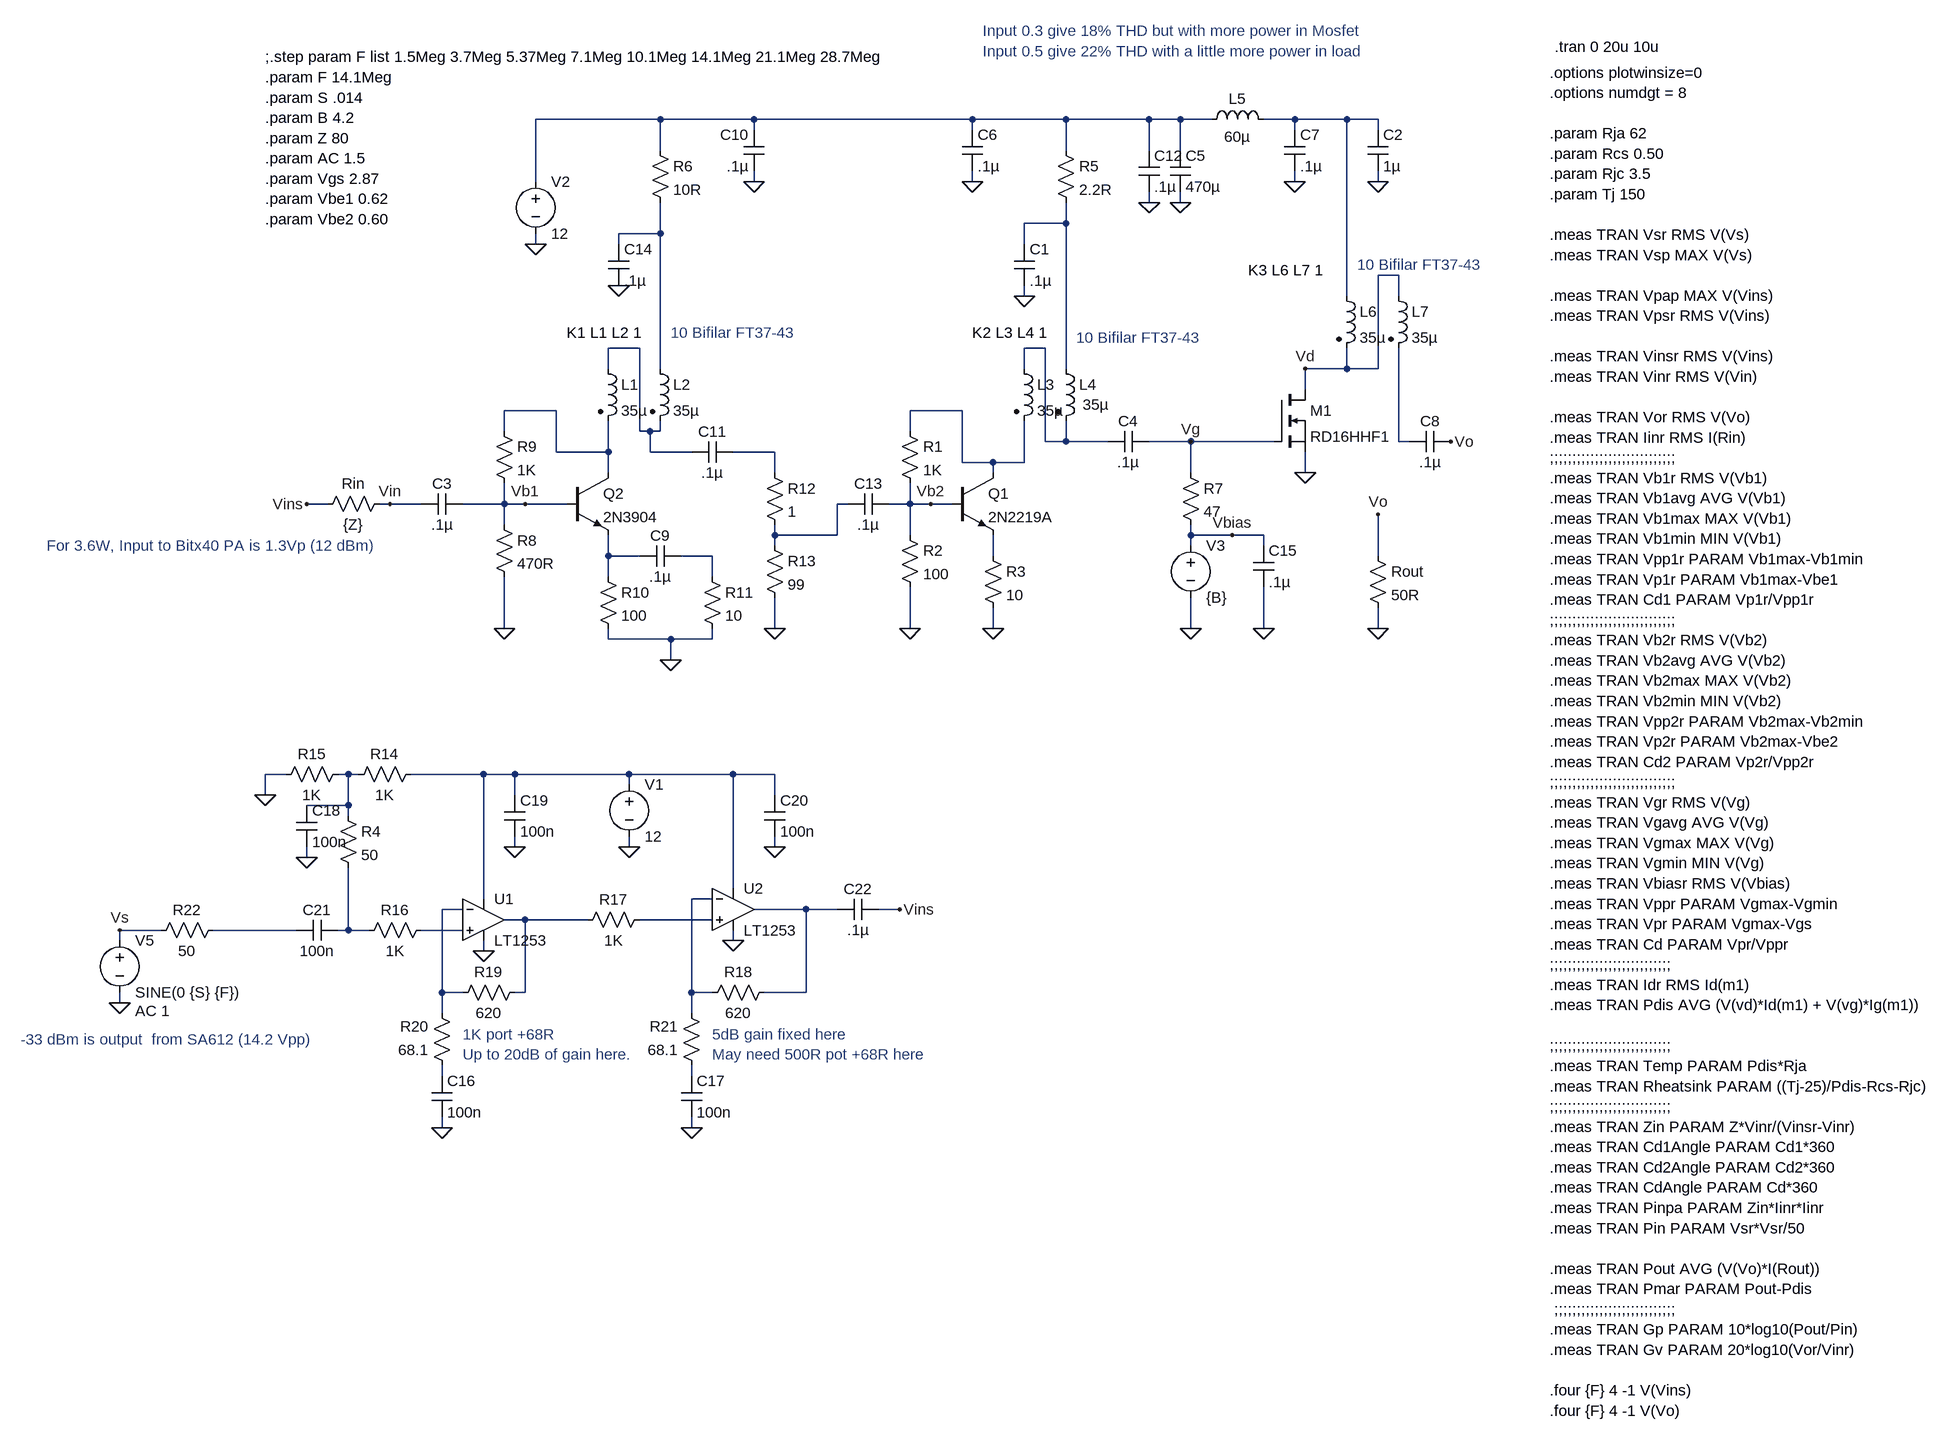
[diagram p0: schematic LT1253+Bitx40 RD16HHF Power Amp.asc]
LT1253+Bitx40 RD16HHF Power Amp.asc, the LTspice schematic file:
Version 4
SHEET 1 3060 1616
WIRE 320 -400 128 -400
WIRE 464 -400 320 -400
WIRE 800 -400 464 -400
WIRE 944 -400 800 -400
WIRE 1072 -400 944 -400
WIRE 1120 -400 1072 -400
WIRE 1168 -400 1120 -400
WIRE 1296 -400 1248 -400
WIRE 1376 -400 1296 -400
WIRE 1424 -400 1376 -400
WIRE 464 -384 464 -400
WIRE 800 -384 800 -400
WIRE 1296 -384 1296 -400
WIRE 1424 -384 1424 -400
WIRE 320 -352 320 -400
WIRE 944 -352 944 -400
WIRE 1072 -352 1072 -400
WIRE 1120 -352 1120 -400
WIRE 128 -304 128 -400
WIRE 464 -304 464 -320
WIRE 800 -304 800 -320
WIRE 1296 -304 1296 -320
WIRE 1424 -304 1424 -320
WIRE 1072 -272 1072 -288
WIRE 1120 -272 1120 -288
WIRE 944 -240 944 -272
WIRE 944 -240 880 -240
WIRE 320 -224 320 -272
WIRE 320 -224 256 -224
WIRE 128 -208 128 -224
WIRE 256 -208 256 -224
WIRE 880 -208 880 -240
WIRE 1456 -160 1424 -160
WIRE 880 -128 880 -144
WIRE 1376 -128 1376 -400
WIRE 1456 -128 1456 -160
WIRE 288 -48 240 -48
WIRE 912 -48 880 -48
WIRE 240 -16 240 -48
WIRE 320 -16 320 -224
WIRE 880 -16 880 -48
WIRE 944 -16 944 -240
WIRE 1376 -16 1376 -48
WIRE 1376 -16 1312 -16
WIRE 1424 -16 1424 -160
WIRE 1424 -16 1376 -16
WIRE 1312 16 1312 -16
WIRE 160 48 80 48
WIRE 784 48 704 48
WIRE 80 80 80 48
WIRE 288 80 288 -48
WIRE 304 80 288 80
WIRE 320 80 320 64
WIRE 320 80 304 80
WIRE 704 80 704 48
WIRE 912 96 912 -48
WIRE 944 96 944 64
WIRE 944 96 912 96
WIRE 1008 96 944 96
WIRE 1136 96 1072 96
WIRE 1264 96 1136 96
WIRE 1456 96 1456 -48
WIRE 1472 96 1456 96
WIRE 160 112 160 48
WIRE 240 112 240 64
WIRE 240 112 160 112
WIRE 304 112 304 80
WIRE 368 112 304 112
WIRE 496 112 432 112
WIRE 784 128 784 48
WIRE 832 128 784 128
WIRE 880 128 880 64
WIRE 880 128 832 128
WIRE 240 144 240 112
WIRE 496 144 496 112
WIRE 832 144 832 128
WIRE 1136 144 1136 96
WIRE 1312 144 1312 112
WIRE -192 192 -224 192
WIRE -96 192 -112 192
WIRE -48 192 -96 192
WIRE 80 192 80 160
WIRE 80 192 16 192
WIRE 112 192 80 192
WIRE 176 192 112 192
WIRE 608 192 592 192
WIRE 704 192 704 160
WIRE 704 192 672 192
WIRE 736 192 704 192
WIRE 768 192 736 192
WIRE 80 224 80 192
WIRE 496 240 496 224
WIRE 592 240 592 192
WIRE 592 240 496 240
WIRE 704 240 704 192
WIRE 1136 240 1136 224
WIRE 1200 240 1136 240
WIRE 1248 240 1200 240
WIRE 496 256 496 240
WIRE 1136 256 1136 240
WIRE 1248 256 1248 240
WIRE 240 272 240 240
WIRE 288 272 240 272
WIRE 400 272 352 272
WIRE 832 272 832 240
WIRE 1424 272 1424 208
WIRE 240 304 240 272
WIRE 400 304 400 272
WIRE 80 384 80 304
WIRE 496 384 496 336
WIRE 704 384 704 320
WIRE 832 384 832 352
WIRE 1136 384 1136 336
WIRE 1248 384 1248 320
WIRE 1424 384 1424 352
WIRE 240 400 240 384
WIRE 336 400 240 400
WIRE 400 400 400 384
WIRE 400 400 336 400
WIRE 336 432 336 400
WIRE -256 608 -288 608
WIRE -160 608 -176 608
WIRE -144 608 -160 608
WIRE 48 608 -64 608
WIRE 96 608 48 608
WIRE 272 608 96 608
WIRE 432 608 272 608
WIRE 496 608 432 608
WIRE 272 624 272 608
WIRE -288 640 -288 608
WIRE 96 640 96 608
WIRE 496 640 496 608
WIRE -160 656 -160 608
WIRE -160 656 -224 656
WIRE -160 672 -160 656
WIRE 96 720 96 704
WIRE 272 720 272 704
WIRE 496 720 496 704
WIRE -224 736 -224 720
WIRE 432 784 432 608
WIRE 48 800 48 608
WIRE 400 800 368 800
WIRE 16 816 -16 816
WIRE 544 816 464 816
WIRE 592 816 544 816
WIRE 688 816 656 816
WIRE 112 832 80 832
WIRE 208 832 112 832
WIRE 400 832 288 832
WIRE -448 848 -512 848
WIRE -240 848 -368 848
WIRE -160 848 -160 752
WIRE -160 848 -176 848
WIRE -128 848 -160 848
WIRE 16 848 -48 848
WIRE -512 864 -512 848
WIRE 432 864 432 848
WIRE 48 880 48 864
WIRE -16 944 -16 816
WIRE 16 944 -16 944
WIRE 112 944 112 832
WIRE 112 944 96 944
WIRE 368 944 368 800
WIRE 400 944 368 944
WIRE 544 944 544 816
WIRE 544 944 480 944
WIRE -512 960 -512 944
WIRE -16 976 -16 944
WIRE 368 976 368 944
WIRE -16 1072 -16 1056
WIRE 368 1072 368 1056
WIRE -16 1152 -16 1136
WIRE 368 1152 368 1136
FLAG 704 384 0
FLAG 832 384 0
FLAG 128 -208 0
FLAG 880 -128 0
FLAG 1136 384 0
FLAG 1312 144 0
FLAG 1120 -272 0
FLAG 800 -304 0
FLAG 1296 -304 0
FLAG -96 192 Vin
FLAG -224 192 Vins
FLAG 1536 96 Vo
FLAG 464 -304 0
FLAG 336 432 0
FLAG 80 384 0
FLAG 496 384 0
FLAG 1424 -304 0
FLAG 1072 -272 0
FLAG 1424 384 0
FLAG 1424 208 Vo
FLAG 256 -144 0
FLAG 1248 384 0
FLAG 1136 96 Vg
FLAG 1200 240 Vbias
FLAG 1312 -16 Vd
FLAG 736 192 Vb2
FLAG 112 192 Vb1
FLAG 96 720 0
FLAG -224 736 0
FLAG 48 880 0
FLAG 432 864 0
FLAG 368 1152 0
FLAG 496 720 0
FLAG -288 640 0
FLAG -16 1152 0
FLAG 688 816 Vins
FLAG 272 720 0
FLAG -512 960 0
FLAG -512 848 Vs
SYMBOL npn 768 144 R0
SYMATTR InstName Q1
SYMATTR Value 2N2219A
SYMBOL res 688 64 R0
SYMATTR InstName R1
SYMATTR Value 1K
SYMBOL res 688 224 R0
SYMATTR InstName R2
SYMATTR Value 100
SYMBOL res 816 256 R0
SYMATTR InstName R3
SYMATTR Value 10
SYMBOL voltage 128 -320 R0
WINDOW 123 0 0 Left 2
WINDOW 39 0 0 Left 2
SYMATTR InstName V2
SYMATTR Value 12
SYMBOL ind2 224 -32 R0
SYMATTR InstName L1
SYMATTR Value 35µ
SYMATTR Type ind
SYMBOL ind2 304 -32 R0
SYMATTR InstName L2
SYMATTR Value 35µ
SYMATTR Type ind
SYMBOL res 928 -368 R0
SYMATTR InstName R5
SYMATTR Value 2.2R
SYMBOL cap 864 -208 R0
SYMATTR InstName C1
SYMATTR Value .1µ
SYMBOL res -96 176 R90
WINDOW 0 0 56 VBottom 2
WINDOW 3 32 56 VTop 2
SYMATTR InstName Rin
SYMATTR Value {Z}
SYMBOL cap 16 176 R90
WINDOW 0 0 32 VBottom 2
WINDOW 3 32 32 VTop 2
SYMATTR InstName C3
SYMATTR Value .1µ
SYMBOL cap 1072 80 R90
WINDOW 0 0 32 VBottom 2
WINDOW 3 32 32 VTop 2
SYMATTR InstName C4
SYMATTR Value .1µ
SYMBOL voltage 1136 240 R0
WINDOW 123 0 0 Left 2
WINDOW 39 0 0 Left 2
SYMATTR InstName V3
SYMATTR Value {B}
SYMBOL res 1120 128 R0
SYMATTR InstName R7
SYMATTR Value 47
SYMBOL ind2 864 -32 R0
SYMATTR InstName L3
SYMATTR Value 35µ
SYMATTR Type ind
SYMBOL ind2 928 -32 R0
WINDOW 3 42 71 Left 2
SYMATTR Value 35µ
SYMATTR InstName L4
SYMATTR Type ind
SYMBOL ind 1152 -384 R270
WINDOW 0 32 56 VTop 2
WINDOW 3 5 56 VBottom 2
SYMATTR InstName L5
SYMATTR Value 60µ
SYMBOL cap 1104 -352 R0
SYMATTR InstName C5
SYMATTR Value 470µ
SYMBOL cap 784 -384 R0
SYMATTR InstName C6
SYMATTR Value .1µ
SYMBOL cap 1280 -384 R0
SYMATTR InstName C7
SYMATTR Value .1µ
SYMBOL cap 1536 80 R90
WINDOW 0 0 32 VBottom 2
WINDOW 3 32 32 VTop 2
SYMATTR InstName C8
SYMATTR Value .1µ
SYMBOL npn 176 144 R0
SYMATTR InstName Q2
SYMATTR Value 2N3904
SYMBOL res 64 208 R0
SYMATTR InstName R8
SYMATTR Value 470R
SYMBOL res 64 64 R0
SYMATTR InstName R9
SYMATTR Value 1K
SYMBOL res 224 288 R0
SYMATTR InstName R10
SYMATTR Value 100
SYMBOL res 384 288 R0
SYMATTR InstName R11
SYMATTR Value 10
SYMBOL cap 352 256 R90
WINDOW 0 0 32 VBottom 2
WINDOW 3 32 32 VTop 2
SYMATTR InstName C9
SYMATTR Value .1µ
SYMBOL cap 480 -320 R180
WINDOW 0 24 56 Left 2
WINDOW 3 24 8 Left 2
SYMATTR InstName C10
SYMATTR Value .1µ
SYMBOL cap 368 128 R270
WINDOW 0 32 32 VTop 2
WINDOW 3 0 32 VBottom 2
SYMATTR InstName C11
SYMATTR Value .1µ
SYMBOL ind2 1360 -144 R0
SYMATTR InstName L6
SYMATTR Value 35µ
SYMATTR Type ind
SYMBOL ind2 1440 -144 R0
SYMATTR InstName L7
SYMATTR Value 35µ
SYMATTR Type ind
SYMBOL res 480 128 R0
SYMATTR InstName R12
SYMATTR Value 1
SYMBOL res 480 240 R0
SYMATTR InstName R13
SYMATTR Value 99
SYMBOL cap 1408 -384 R0
SYMATTR InstName C2
SYMATTR Value 1µ
SYMBOL cap 1056 -352 R0
SYMATTR InstName C12
SYMATTR Value .1µ
SYMBOL res 1408 256 R0
SYMATTR InstName Rout
SYMATTR Value 50R
SYMBOL res 304 -368 R0
SYMATTR InstName R6
SYMATTR Value 10R
SYMBOL cap 608 208 R270
WINDOW 0 32 32 VTop 2
WINDOW 3 0 32 VBottom 2
SYMATTR InstName C13
SYMATTR Value .1µ
SYMBOL cap 240 -208 R0
SYMATTR InstName C14
SYMATTR Value .1µ
SYMBOL cap 1232 256 R0
SYMATTR InstName C15
SYMATTR Value .1µ
SYMBOL Opamps\\LT1253 48 768 R0
SYMATTR InstName U1
SYMBOL Opamps\\LT1253 432 752 R0
SYMATTR InstName U2
SYMBOL res -176 656 R0
SYMATTR InstName R4
SYMATTR Value 50
SYMBOL res -48 592 R90
WINDOW 0 0 56 VBottom 2
WINDOW 3 32 56 VTop 2
SYMATTR InstName R14
SYMATTR Value 1K
SYMBOL res -160 592 R90
WINDOW 0 0 56 VBottom 2
WINDOW 3 32 56 VTop 2
SYMATTR InstName R15
SYMATTR Value 1K
SYMBOL res -32 832 R90
WINDOW 0 0 56 VBottom 2
WINDOW 3 32 56 VTop 2
SYMATTR InstName R16
SYMATTR Value 1K
SYMBOL res 304 816 R90
WINDOW 0 0 56 VBottom 2
WINDOW 3 32 56 VTop 2
SYMATTR InstName R17
SYMATTR Value 1K
SYMBOL res 496 928 R90
WINDOW 0 0 56 VBottom 2
WINDOW 3 32 56 VTop 2
SYMATTR InstName R18
SYMATTR Value 620
SYMBOL res 112 928 R90
WINDOW 0 0 56 VBottom 2
WINDOW 3 32 56 VTop 2
SYMATTR InstName R19
SYMATTR Value 620
SYMBOL res 0 1072 R180
WINDOW 0 36 76 Left 2
WINDOW 3 36 40 Left 2
SYMATTR InstName R20
SYMATTR Value 68.1
SYMBOL res 384 1072 R180
WINDOW 0 36 76 Left 2
WINDOW 3 36 40 Left 2
SYMATTR InstName R21
SYMATTR Value 68.1
SYMBOL cap -32 1072 R0
SYMATTR InstName C16
SYMATTR Value 100n
SYMBOL cap 352 1072 R0
SYMATTR InstName C17
SYMATTR Value 100n
SYMBOL cap -240 656 R0
SYMATTR InstName C18
SYMATTR Value 100n
SYMBOL cap 80 640 R0
SYMATTR InstName C19
SYMATTR Value 100n
SYMBOL cap 480 640 R0
SYMATTR InstName C20
SYMATTR Value 100n
SYMBOL cap -176 832 R90
WINDOW 0 0 32 VBottom 2
WINDOW 3 32 32 VTop 2
SYMATTR InstName C21
SYMATTR Value 100n
SYMBOL res -352 832 R90
WINDOW 0 0 56 VBottom 2
WINDOW 3 32 56 VTop 2
SYMATTR InstName R22
SYMATTR Value 50
SYMBOL voltage 272 608 R0
WINDOW 123 0 0 Left 2
WINDOW 39 0 0 Left 2
SYMATTR InstName V1
SYMATTR Value 12
SYMBOL voltage -512 848 R0
WINDOW 123 24 124 Left 2
WINDOW 39 0 0 Left 2
SYMATTR Value2 AC 1
SYMATTR InstName V5
SYMATTR Value SINE(0 {S} {F})
SYMBOL cap 656 800 R90
WINDOW 0 0 32 VBottom 2
WINDOW 3 32 32 VTop 2
SYMATTR InstName C22
SYMATTR Value .1µ
SYMBOL nmos 1264 16 R0
SYMATTR InstName M1
SYMATTR Value RD16HHF1
TEXT 176 -72 Left 2 !K1 L1 L2 1
TEXT 800 -72 Left 2 !K2 L3 L4 1
TEXT 960 -64 Left 2 ;10 Bifilar FT37-43
TEXT 1224 -168 Left 2 !K3 L6 L7 1
TEXT 1688 -472 Left 2 !.options plotwinsize=0\n.options numdgt = 8\n \n.param Rja 62\n.param Rcs 0.50\n.param Rjc 3.5\n.param Tj 150\n \n.meas TRAN Vsr RMS V(Vs)\n.meas TRAN Vsp MAX V(Vs)\n \n.meas TRAN Vpap MAX V(Vins) \n.meas TRAN Vpsr RMS V(Vins)\n \n.meas TRAN Vinsr RMS V(Vins)\n.meas TRAN Vinr RMS V(Vin)\n \n.meas TRAN Vor RMS V(Vo)\n.meas TRAN Iinr RMS I(Rin)\n;;;;;;;;;;;;;;;;;;;;;;;;;;;;\n.meas TRAN Vb1r RMS V(Vb1)\n.meas TRAN Vb1avg AVG V(Vb1)\n.meas TRAN Vb1max MAX V(Vb1)\n.meas TRAN Vb1min MIN V(Vb1)\n.meas TRAN Vpp1r PARAM Vb1max-Vb1min\n.meas TRAN Vp1r PARAM Vb1max-Vbe1\n.meas TRAN Cd1 PARAM Vp1r/Vpp1r\n;;;;;;;;;;;;;;;;;;;;;;;;;;;;\n.meas TRAN Vb2r RMS V(Vb2)\n.meas TRAN Vb2avg AVG V(Vb2)\n.meas TRAN Vb2max MAX V(Vb2)\n.meas TRAN Vb2min MIN V(Vb2)\n.meas TRAN Vpp2r PARAM Vb2max-Vb2min\n.meas TRAN Vp2r PARAM Vb2max-Vbe2\n.meas TRAN Cd2 PARAM Vp2r/Vpp2r\n;;;;;;;;;;;;;;;;;;;;;;;;;;;;\n.meas TRAN Vgr RMS V(Vg)\n.meas TRAN Vgavg AVG V(Vg)\n.meas TRAN Vgmax MAX V(Vg)\n.meas TRAN Vgmin MIN V(Vg)\n.meas TRAN Vbiasr RMS V(Vbias)\n.meas TRAN Vppr PARAM Vgmax-Vgmin\n.meas TRAN Vpr PARAM Vgmax-Vgs\n.meas TRAN Cd PARAM Vpr/Vppr\n;;;;;;;;;;;;;;;;;;;;;;;;;;;\n.meas TRAN Idr RMS Id(m1) \n.meas TRAN Pdis AVG (V(vd)*Id(m1) + V(vg)*Ig(m1))\n \n;;;;;;;;;;;;;;;;;;;;;;;;;;;\n.meas TRAN Temp PARAM Pdis*Rja\n.meas TRAN Rheatsink PARAM ((Tj-25)/Pdis-Rcs-Rjc)\n;;;;;;;;;;;;;;;;;;;;;;;;;;;\n.meas TRAN Zin PARAM Z*Vinr/(Vinsr-Vinr)\n.meas TRAN Cd1Angle PARAM Cd1*360\n.meas TRAN Cd2Angle PARAM Cd2*360\n.meas TRAN CdAngle PARAM Cd*360\n.meas TRAN Pinpa PARAM Zin*Iinr*Iinr\n.meas TRAN Pin PARAM Vsr*Vsr/50\n \n.meas TRAN Pout AVG (V(Vo)*I(Rout))\n.meas TRAN Pmar PARAM Pout-Pdis\n ;;;;;;;;;;;;;;;;;;;;;;;;;;;\n.meas TRAN Gp PARAM 10*log10(Pout/Pin)\n.meas TRAN Gv PARAM 20*log10(Vor/Vinr)\n \n.four {F} 4 -1 V(Vins)\n.four {F} 4 -1 V(Vo)
TEXT 1696 -512 Left 2 !.tran 0 20u 10u
TEXT 336 -72 Left 2 ;10 Bifilar FT37-43
TEXT 1392 -176 Left 2 ;10 Bifilar FT37-43
TEXT 816 -536 Left 2 ;Input 0.3 give 18% THD but with more power in Mosfet\nInput 0.5 give 22% THD with a little more power in load
TEXT -664 1016 Left 2 ;-33 dBm is output  from SA612 (14.2 Vpp)
TEXT 400 1008 Left 2 ;5dB gain fixed here\nMay need 500R pot +68R here
TEXT 16 1008 Left 2 ;1K port +68R  \nUp to 20dB of gain here.
TEXT -624 256 Left 2 ;For 3.6W, Input to Bitx40 PA is 1.3Vp (12 dBm)
TEXT -288 -496 Left 2 !;.step param F list 1.5Meg 3.7Meg 5.37Meg 7.1Meg 10.1Meg 14.1Meg 21.1Meg 28.7Meg\n.param F 14.1Meg\n.param S .014\n.param B 4.2\n.param Z 80\n.param AC 1.5\n.param Vgs 2.87\n.param Vbe1 0.62\n.param Vbe2 0.60

The netlist it stands for:
* LT1253+Bitx40 RD16HHF Power Amp.asc
Q1 N008 Vb2 N014 0 2N2219A
R1 N008 Vb2 1K
R2 Vb2 0 100
R3 N014 0 10
V2 N001 0 12
L1 N005 N007 35µ
L2 N004 N005 35µ
R5 N001 N003 2.2R
C1 N003 0 .1µ
Rin Vin Vins {Z}
C3 Vb1 Vin .1µ
C4 Vg N006 .1µ
V3 Vbias 0 {B}
R7 Vg Vbias 47
L3 N006 N008 35µ
L4 N003 N006 35µ
L5 N001 N002 60µ
C5 N001 0 470µ
C6 N001 0 .1µ
C7 N002 0 .1µ
C8 Vo N009 .1µ
Q2 N007 Vb1 N012 0 2N3904
R8 Vb1 0 470R
R9 N007 Vb1 1K
R10 N012 0 100
R11 N013 0 10
C9 N013 N012 .1µ
C10 0 N001 .1µ
C11 N005 N010 .1µ
L6 N002 Vd 35µ
L7 Vd N009 35µ
R12 N010 N011 1
R13 N011 0 99
C2 N002 0 1µ
C12 N001 0 .1µ
Rout Vo 0 50R
R6 N001 N004 10R
C13 N011 Vb2 .1µ
C14 N004 0 .1µ
C15 Vbias 0 .1µ
XU1 N024 N018 N016 0 N020 LT1253  ; pins In+ In- V+ V- OUT
XU2 N021 N017 N016 0 N019 LT1253  ; pins In+ In- V+ V- OUT
R4 N015 N023 50
R14 N016 N015 1K
R15 N015 0 1K
R16 N024 N023 1K
R17 N021 N020 1K
R18 N019 N017 620
R19 N020 N018 620
R20 N025 N018 68.1
R21 N026 N017 68.1
C16 N025 0 100n
C17 N026 0 100n
C18 N015 0 100n
C19 N016 0 100n
C20 N016 0 100n
C21 N023 N022 100n
R22 N022 Vs 50
V1 N016 0 12
V5 Vs 0 SINE(0 {S} {F}) AC 1
C22 Vins N019 .1µ
M1 Vd Vg 0 0 RD16HHF1
.model NPN NPN
.model PNP PNP
.lib standard.bjt
.model NMOS NMOS
.model PMOS PMOS
.lib standard.mos
K1 L1 L2 1
K2 L3 L4 1
* 10 Bifilar FT37-43
K3 L6 L7 1
.options plotwinsize=0
.options numdgt = 8
.param Rja 62
.param Rcs 0.50
.param Rjc 3.5
.param Tj 150
.meas TRAN Vsr RMS V(Vs)
.meas TRAN Vsp MAX V(Vs)
.meas TRAN Vpap MAX V(Vins)
.meas TRAN Vpsr RMS V(Vins)
.meas TRAN Vinsr RMS V(Vins)
.meas TRAN Vinr RMS V(Vin)
.meas TRAN Vor RMS V(Vo)
.meas TRAN Iinr RMS I(Rin)
;;;;;;;;;;;;;;;;;;;;;;;;;;;;
.meas TRAN Vb1r RMS V(Vb1)
.meas TRAN Vb1avg AVG V(Vb1)
.meas TRAN Vb1max MAX V(Vb1)
.meas TRAN Vb1min MIN V(Vb1)
.meas TRAN Vpp1r PARAM Vb1max-Vb1min
.meas TRAN Vp1r PARAM Vb1max-Vbe1
.meas TRAN Cd1 PARAM Vp1r/Vpp1r
;;;;;;;;;;;;;;;;;;;;;;;;;;;;
.meas TRAN Vb2r RMS V(Vb2)
.meas TRAN Vb2avg AVG V(Vb2)
.meas TRAN Vb2max MAX V(Vb2)
.meas TRAN Vb2min MIN V(Vb2)
.meas TRAN Vpp2r PARAM Vb2max-Vb2min
.meas TRAN Vp2r PARAM Vb2max-Vbe2
.meas TRAN Cd2 PARAM Vp2r/Vpp2r
;;;;;;;;;;;;;;;;;;;;;;;;;;;;
.meas TRAN Vgr RMS V(Vg)
.meas TRAN Vgavg AVG V(Vg)
.meas TRAN Vgmax MAX V(Vg)
.meas TRAN Vgmin MIN V(Vg)
.meas TRAN Vbiasr RMS V(Vbias)
.meas TRAN Vppr PARAM Vgmax-Vgmin
.meas TRAN Vpr PARAM Vgmax-Vgs
.meas TRAN Cd PARAM Vpr/Vppr
;;;;;;;;;;;;;;;;;;;;;;;;;;;
.meas TRAN Idr RMS Id(m1)
.meas TRAN Pdis AVG (V(vd)*Id(m1) + V(vg)*Ig(m1))
;;;;;;;;;;;;;;;;;;;;;;;;;;;
.meas TRAN Temp PARAM Pdis*Rja
.meas TRAN Rheatsink PARAM ((Tj-25)/Pdis-Rcs-Rjc)
;;;;;;;;;;;;;;;;;;;;;;;;;;;
.meas TRAN Zin PARAM Z*Vinr/(Vinsr-Vinr)
.meas TRAN Cd1Angle PARAM Cd1*360
.meas TRAN Cd2Angle PARAM Cd2*360
.meas TRAN CdAngle PARAM Cd*360
.meas TRAN Pinpa PARAM Zin*Iinr*Iinr
.meas TRAN Pin PARAM Vsr*Vsr/50
.meas TRAN Pout AVG (V(Vo)*I(Rout))
.meas TRAN Pmar PARAM Pout-Pdis
 ;;;;;;;;;;;;;;;;;;;;;;;;;;;
.meas TRAN Gp PARAM 10*log10(Pout/Pin)
.meas TRAN Gv PARAM 20*log10(Vor/Vinr)
.four {F} 4 -1 V(Vins)
.four {F} 4 -1 V(Vo)
.tran 0 20u 10u
* 10 Bifilar FT37-43
* 10 Bifilar FT37-43
* Input 0.3 give 18% THD but with more power in Mosfet
* Input 0.5 give 22% THD with a little more power in load
* -33 dBm is output  from SA612 (14.2 Vpp)
* 5dB gain fixed here
* May need 500R pot +68R here
* 1K port +68R
* Up to 20dB of gain here.
* For 3.6W, Input to Bitx40 PA is 1.3Vp (12 dBm)
;.step param F list 1.5Meg 3.7Meg 5.37Meg 7.1Meg 10.1Meg 14.1Meg 21.1Meg 28.7Meg
.param F 14.1Meg
.param S .014
.param B 4.2
.param Z 80
.param AC 1.5
.param Vgs 2.87
.param Vbe1 0.62
.param Vbe2 0.60
.backanno
.end